# Altium project EthernetMotorController.PrjPcb
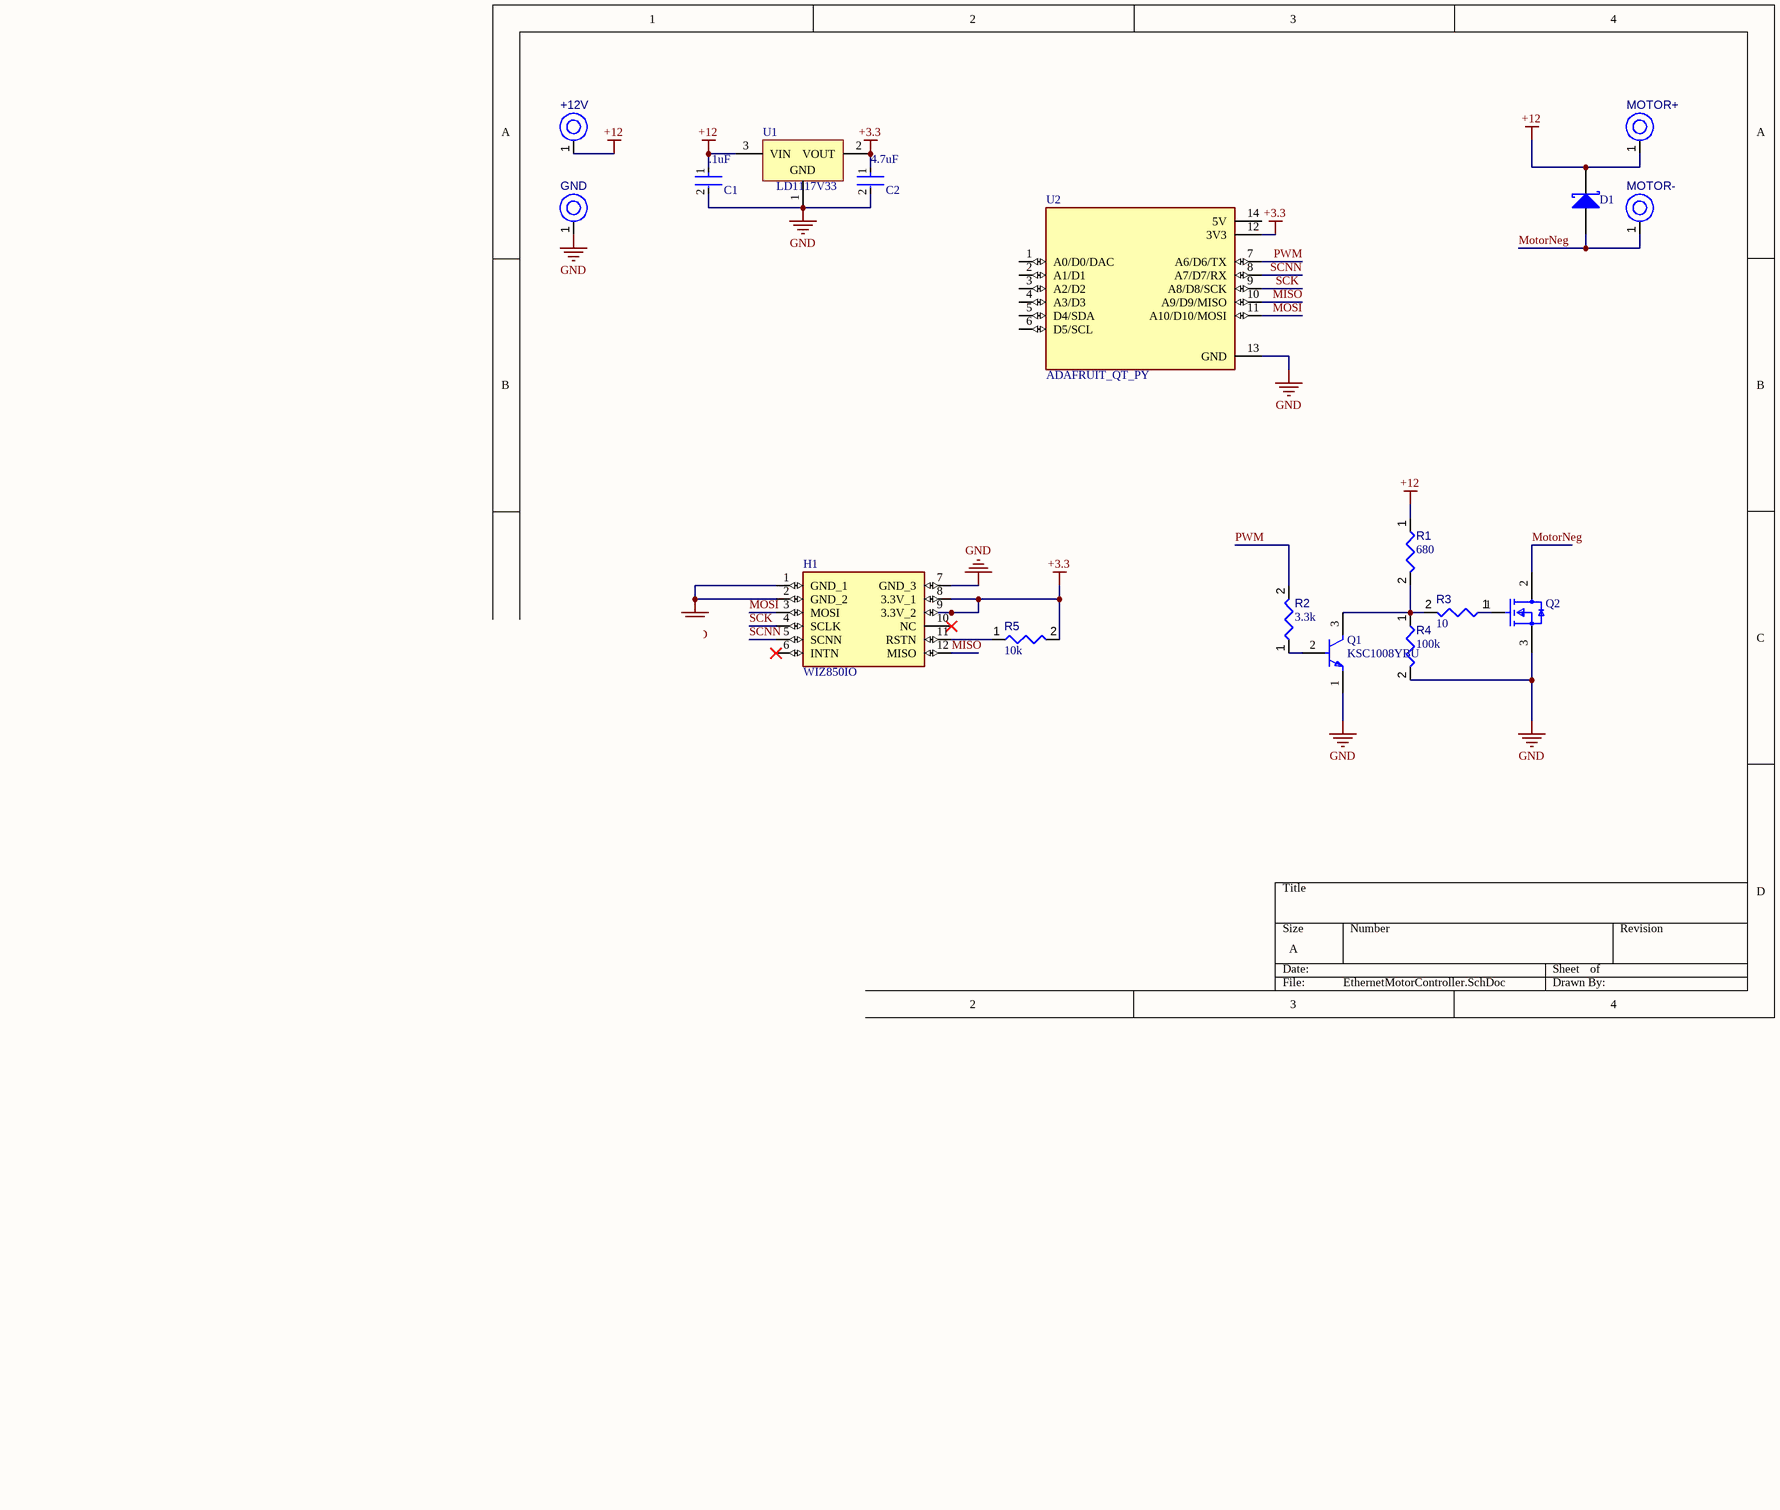
[diagram p0: EthernetMotorController.SchDoc]
1 sheet, 17 parts. Net scope: global (net labels, ports and power ports of the same name join across sheets).
Board file: EthernetMotorController.PcbDoc

## Sheet EthernetMotorController.SchDoc
size A; SheetNumber: 1; SheetTotal: 1

### Parts
+12V  PTH-M2D5X5  [PTH-M2D5X5]  (value not drawn)
C1  .1uF  [FP-RDEWK1-MFG]
C2  4.7uF  [FP-RDEWK1-MFG]
D1  MBR360G  [ONSC-AXIAL_LEAD-2-267-05_V]  (value not drawn)
GND  PTH-M2D5X5  [PTH-M2D5X5]  (value not drawn)
H1  WIZ850IO  [WIZ850IO]
MOTOR+  PTH-M2D5X5  [PTH-M2D5X5]  (value not drawn)
MOTOR-  PTH-M2D5X5  [PTH-M2D5X5]  (value not drawn)
Q1  KSC1008YBU  [FP-135AN-MFG]
Q2  CSD18534KCS  [FP-KCS0003B-MFG]  (value not drawn)
R1  value 680  [RESA60-630X240]  (hidden comment: MFR-25FBF52-100R)
R2  value 3.3k  [RESA60-630X240]  (hidden comment: MFR-25FBF52-10K)
R3  value 10  [RESA60-630X240]  (hidden comment: MFR-25FBF52-100R)
R4  value 100k  [RESA60-630X240]  (hidden comment: MFR-25FBF52-100R)
R5  value 10k  [RESA60-630X240]  (hidden comment: MFR-25FBF52-100R)
U1  LD1117V33  [STM-TO220-3]
U2  ADAFRUIT_QT_PY  [MODULE_ADAFRUIT_QT_PY]

### Nets
+3.3: C2.1 H1.8(3.3V_1) H1.9(3.3V_2) R5.2 U1.2(VOUT) U2.12(3V3)
+12: +12V.1(H1) C1.1 D1.2(K) MOTOR+.1(H1) R1.1 U1.3(VIN)
GND: C1.2 C2.2 GND.1(H1) H1.1(GND_1) H1.2(GND_2) H1.7(GND_3) Q1.1(E) Q2.3(Source) R4.2 U1.1(GND) U2.13(GND)
MISO: H1.12(MISO) U2.10(A9/D9/MISO)
MOSI: H1.3(MOSI) U2.11(A10/D10/MOSI)
MotorNeg: D1.1(A) MOTOR-.1(H1) Q2.2(Drain)
PWM: R2.2 U2.7(A6/D6/TX)
SCK: H1.4(SCLK) U2.9(A8/D8/SCK)
SCNN: H1.5(SCNN) U2.8(A7/D7/RX)
NetH1_11: H1.11(RSTN) R5.1
NetQ1_2: Q1.2(B) R2.1
NetQ1_3: Q1.3(C) R1.2 R3.2 R4.1
NetQ2_1: Q2.1(Gate) R3.1

Not connected (* = marked no-connect by the designer): H1 6(INTN)* 10(NC)*; U2 1(A0/D0/DAC) 2(A1/D1) 3(A2/D2) 4(A3/D3) 5(D4/SDA) 6(D5/SCL) 14(5V)

### Library data of the parts
+12V GND MOTOR+ MOTOR- = CMP-00028-00004-2: M2 PTH (2.5mm), 5mm pad; Pins: 1
C1 C2 = CMP-001-00083-1: Cap Ceramic 4.7uF 100V X7S 20% Radial 5mm 125C Bulk
D1 = CMP-1055-00015-2: Axial Lead Rectifier, 60 V, 3 A, -65 to 150 degC, 2-Pin DO-201AD, RoHS, Bag; Case\Package: 0603; Colour: Green; Power Rating: 52 mW; Forward Current: 20 mA; Viewing Angle: 170 degrees; Forward Voltage: 2.2 V; Nominal Wavelength: 572 nm; Luminous Intensity: 15 mcd; Lens Style: Diffused; Max Operating Temperature: 85 degC; ComponentLink2URL: http://www.onsemi.cn/pub_link/Collateral/MBR350-D.PDF; PackageDescription: 2-Pin Axial Lead, Dia 5.05 mm, Body Length 8.4 mm; PackageReference: AXIAL_LEAD-2-267-05; Min Operating Temperature: -40 degC; Case Code (Imperial): 0603; Height: 0.8 mm; Package Quantity: 4000; Pins: 2; ComponentLink2Description: Datasheet; Illumination Colour: Green; ComponentLink1Description: Manufacturer URL; RoHSCompliant: true; REACH SVHC: No SVHC; Nominal Vf: 2.2 V; Width: 0.8 mm; ComponentLink3Description: Package Specification; Mount: Surface Mount; Packaging: Tape and Reel; DatasheetVersion: Rev. 6, 06/2006; ComponentLink3URL: http://www.onsemi.com/pub_link/Collateral/267-05.PDF; Length: 1.6 mm; ComponentLink1URL: http://www.onsemi.com/; Radiation Hardening: No; Case Code (Metric): 1608
H1 = CMP-005-000000-1: Ethernet - 10/100 Base-T/TX PHY SPI Interface Module; MF: WIZnet; MP: WIZ850IO; SnapEDA_Link: https://www.snapeda.com/parts/WIZ850IO/WIZnet/view-part/?ref=snap; Purchase-URL: https://pricing.snapeda.com/search/part/WIZ850IO/?ref=eda; Price: None; Value: *; Check_prices: https://www.snapeda.com/parts/WIZ850IO/WIZnet/view-part/?ref=eda; Design Item ID: WIZ850IO; Package: Module WIZnet; Source: WIZ850IO.SchLib; Pin Count: 12; Component Type: Standard; Availability: In Stock
Q1 = CMP-00278-84329457-1: KSC1008YBU Small Signal Bipolar Transistor, 0.7A I(C), 60V V(BR)CEO, 1-Element, NPN, Silicon, TO-92; Manufacturer Lifecycle Status: ACTIVE; Emitter Base Voltage (VEBO): 8V; Collector Base Voltage (VCBO): 80V; Number of Elements: 1; Transition Frequency: 50MHz; Max Frequency: 1MHz; hFE Min: 40; Current Rating: 700mA; Collector Emitter Saturation Voltage: 200mV; Max Power Dissipation: 800mW; Element Configuration: Single; Mount: Through Hole; Length: 4.58mm; Voltage Rating (DC): 60V; Collector Emitter Voltage (VCEO): 60V; NexarPartId: 84329457; Lifecycle Status: Production; Schedule B: 8541210080, 8541210080; Case/Package: TO-92; Min Operating Temperature: -55°C; Collector Emitter Breakdown Voltage: 60V; Number of Pins: 3; Max Operating Temperature: 150°C; Weight: 179mg; Lead Free: Lead Free; Radiation Hardening: No; Polarity: NPN; Width: 3.86mm; Max Collector Current: 700mA; Power Dissipation: 800mW; Gain Bandwidth Product: 50MHz; Height: 4.58mm; Packaging: Bulk; RoHS: Compliant; Frequency: 50MHz
Q2 = CMP-013-00037-1: 60-V, N channel NexFET™ power MOSFET, single TO-220, 9.5 mOhm 3-TO-220 -55 to 175
R1 R3-R5 = CMP-009-00046-4: Axial Resistor, 100 Ohm, +/- 1%, 0.25 W, -55 to 155 degC, 2-Pin THD, RoHS, Bulk; Manufacturer: Yageo; Voltage Rating: 250V; Power: 250mW; Packaging: Bulk; Max Operating Temperature: 155°C; Mounting Technology: TH; Datasheet Version: Apr-13; Case/Package: Axial; RoHS Compliant: True; Package Description: 2-Pin Axial Lead, Dia 2.4 mm, Body Length 6.3 mm; Package Quantity: 200; Package Reference: MFR-25; Tolerance: 1%; Composition: CarbonFilm; Datasheet URL: http://www.yageo.com/documents/recent/Yageo%20LR_MFR_2013.pdf; Manufacturer URL: http://www.yageo.com/; Min Operating Temperature: -55°C
R2 = CMP-009-00047-4: Axial Resistor, 10 KOhm, +/- 1%, 0.25 W, -55 to 155 degC, 2-Pin THD, RoHS, Bulk; Manufacturer: Yageo; Power: 250mW; Voltage Rating: 250V; Manufacturer URL: http://www.yageo.com/; Datasheet URL: http://www.yageo.com/documents/recent/Yageo%20LR_MFR_2013.pdf; Package Reference: MFR-25; Min Operating Temperature: -55°C; Mounting Technology: TH; Package Quantity: 200; Case/Package: Axial; Tolerance: 1%; RoHS Compliant: True; Datasheet Version: Apr-13; Packaging: Bulk; Max Operating Temperature: 155°C; Package Description: 2-Pin Axial Lead, Dia 2.4 mm, Body Length 6.3 mm
U1 = CMP-019-00020-3: Low Drop Positive Voltage Regulator, 800 mA, Fixed 3.3 V Output, 0 to 125 degC, 3-Pin TO-220, RoHS, Tube; Manufacturer: STMicroelectronics; Max Supply Voltage: 15V; Max Ouput Current: 800mA; Output Voltage: 3.3V; Power: 12W; Min Supply Voltage: 4.75V; Output Current: 1.3A; Outputs: 1; Min Input Voltage: 4.4V; Dropout Voltage: 1.1V; Datasheet Version: Rev. A, 07/2003; Case/Package: TO-220-3; Package Quantity: 50; Max Input Voltage: 15V; Manufacturer URL: http://www.st.com/; Min Operating Temperature: 0°C; Datasheet URL: http://www.farnell.com/datasheets/1776449.pdf; Max Operating Temperature: 125°C; Nominal Output Voltage: 3.3V; RoHS Compliant: True; Pins: 3; Packaging: Rail/Tube
U2 = CMP-007-000000-1: Castellated Pads - SAMD21 Dev Board with STEMMA QT; MP: Adafruit QT Py; MF: Adafruit Industries; SnapEDA_Link: https://www.snapeda.com/parts/Adafruit%20QT%20Py/Adafruit+Industries/view-part/?ref=snap; Source: ADAFRUIT_QT_PY.SchLib; Design Item ID: ADAFRUIT_QT_PY; Component Type: Standard; Check_prices: https://www.snapeda.com/parts/Adafruit%20QT%20Py/Adafruit+Industries/view-part/?ref=eda; Value: *; Package: None; Pin Count: 14